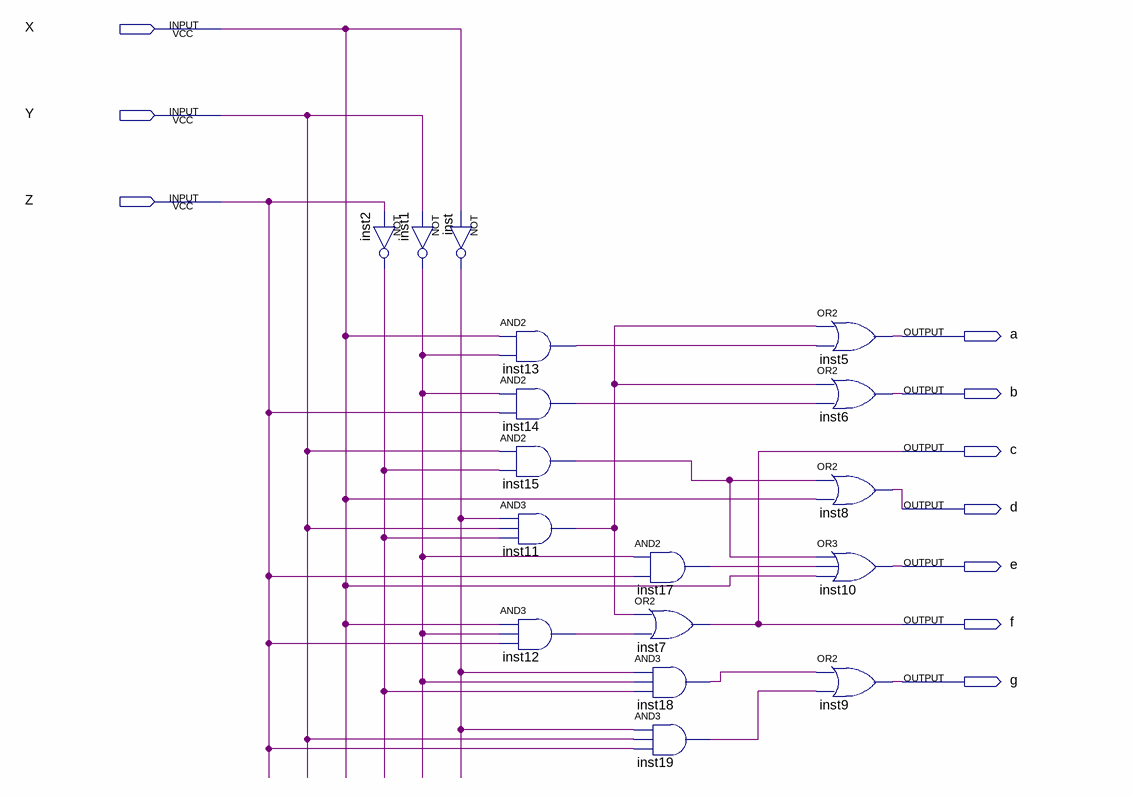
[diagram p0: schematic sheet]
// Quartus schematic Lab7.bdf as structural Verilog: 17 symbols, 10 pins
module Lab7 (
  input  X,
  input  Y,
  input  Z,
  output a,
  output b,
  output c,
  output d,
  output e,
  output f,
  output g
);

  wire inst1_out, inst2_out, inst11_out, inst12_out, inst13_out, inst14_out, inst15_out, inst17_out,
       inst18_out, inst19_out, inst_out;

  not inst2 (inst2_out, Z);
  not inst (inst_out, X);
  not inst1 (inst1_out, Y);
  and inst13 (inst13_out, X, inst1_out);
  and inst14 (inst14_out, inst1_out, Z);
  and inst15 (inst15_out, Y, inst2_out);
  and inst11 (inst11_out, inst_out, Y, inst2_out);
  and inst12 (inst12_out, X, inst1_out, Z);
  and inst17 (inst17_out, inst1_out, Z);
  or inst7 (c, inst11_out, inst12_out);
  and inst18 (inst18_out, inst_out, inst1_out, inst2_out);
  and inst19 (inst19_out, inst_out, Y, Z);
  or inst5 (a, inst11_out, inst13_out);
  or inst6 (b, inst11_out, inst14_out);
  or inst8 (d, inst15_out, X);
  or inst10 (e, inst15_out, inst17_out, X);
  or inst9 (g, inst18_out, inst19_out);

  assign f = c;
endmodule
